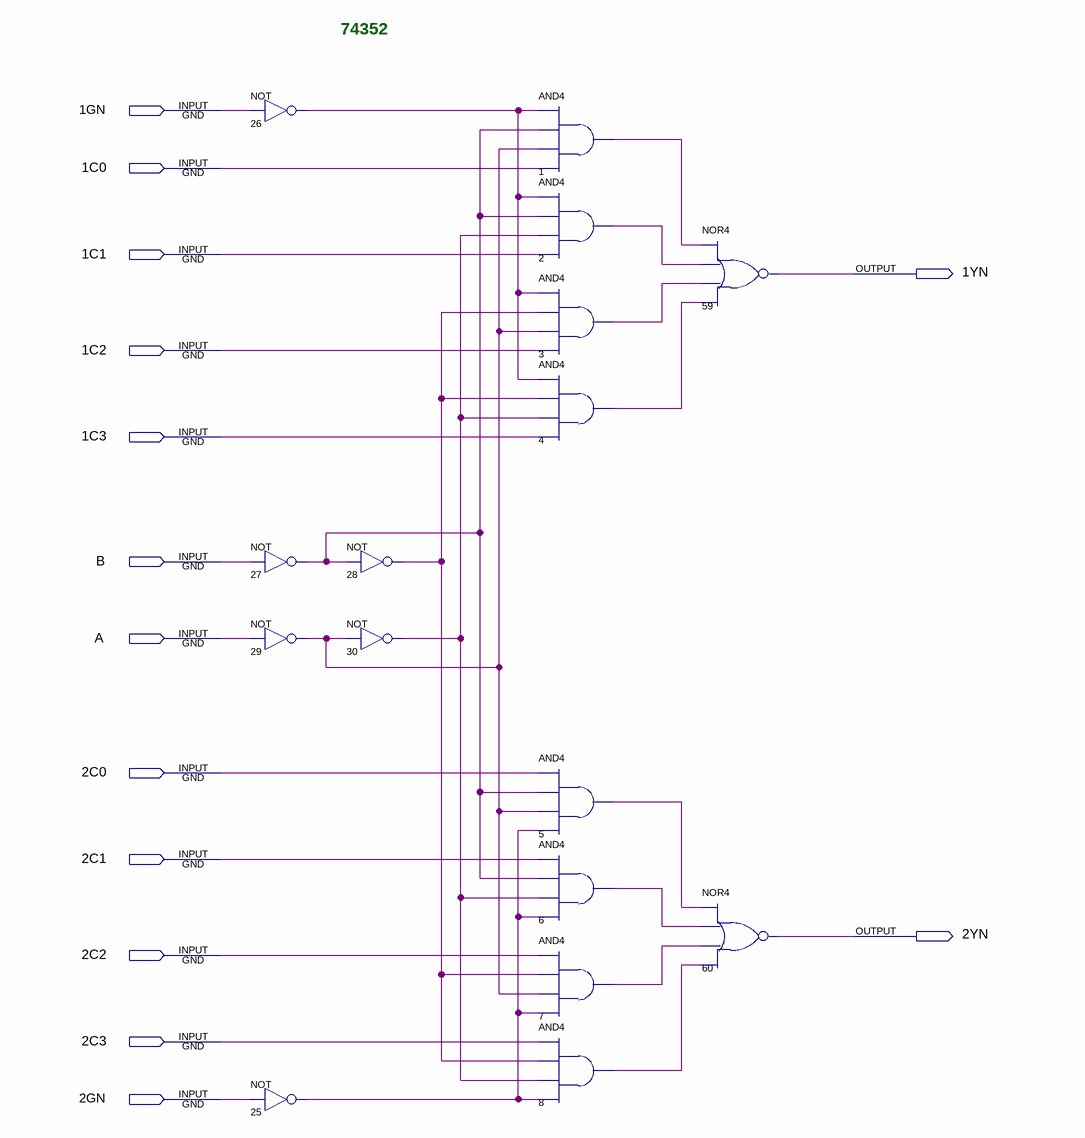
[diagram p0: schematic sheet]
// Quartus schematic 74352.bdf as structural Verilog: 16 symbols, 14 pins
module \74352  (
  input  \1GN ,
  input  \1C0 ,
  input  \1C1 ,
  input  \1C2 ,
  input  \1C3 ,
  input  B,
  input  A,
  input  \2C0 ,
  input  \2C1 ,
  input  \2C2 ,
  input  \2C3 ,
  input  \2GN ,
  output \1YN ,
  output \2YN 
);

  wire n1_out, n2_out, n3_out, n4_out, n5_out, n6_out, n7_out, n8_out, n25_out, n26_out, n27_out, n28_out,
       n29_out, n30_out;

  not u_26 (n26_out, \1GN );
  not u_27 (n27_out, B);
  not u_29 (n29_out, A);
  not u_25 (n25_out, \2GN );
  not u_28 (n28_out, n27_out);
  not u_30 (n30_out, n29_out);
  and u_1 (n1_out, n26_out, n27_out, n29_out, \1C0 );
  and u_2 (n2_out, n26_out, n27_out, n30_out, \1C1 );
  and u_3 (n3_out, n26_out, n28_out, n29_out, \1C2 );
  and u_4 (n4_out, n26_out, n28_out, n30_out, \1C3 );
  and u_5 (n5_out, \2C0 , n27_out, n29_out, n25_out);
  and u_6 (n6_out, \2C1 , n27_out, n30_out, n25_out);
  and u_7 (n7_out, \2C2 , n28_out, n29_out, n25_out);
  and u_8 (n8_out, \2C3 , n28_out, n30_out, n25_out);
  nor u_59 (\1YN , n1_out, n2_out, n3_out, n4_out);
  nor u_60 (\2YN , n5_out, n6_out, n7_out, n8_out);

  // Notes on the sheet:
  //   74352
endmodule
